# EAGLE design 9key_rev0.1a (EAGLE 8.3.1)

## Sheet 1 of 2
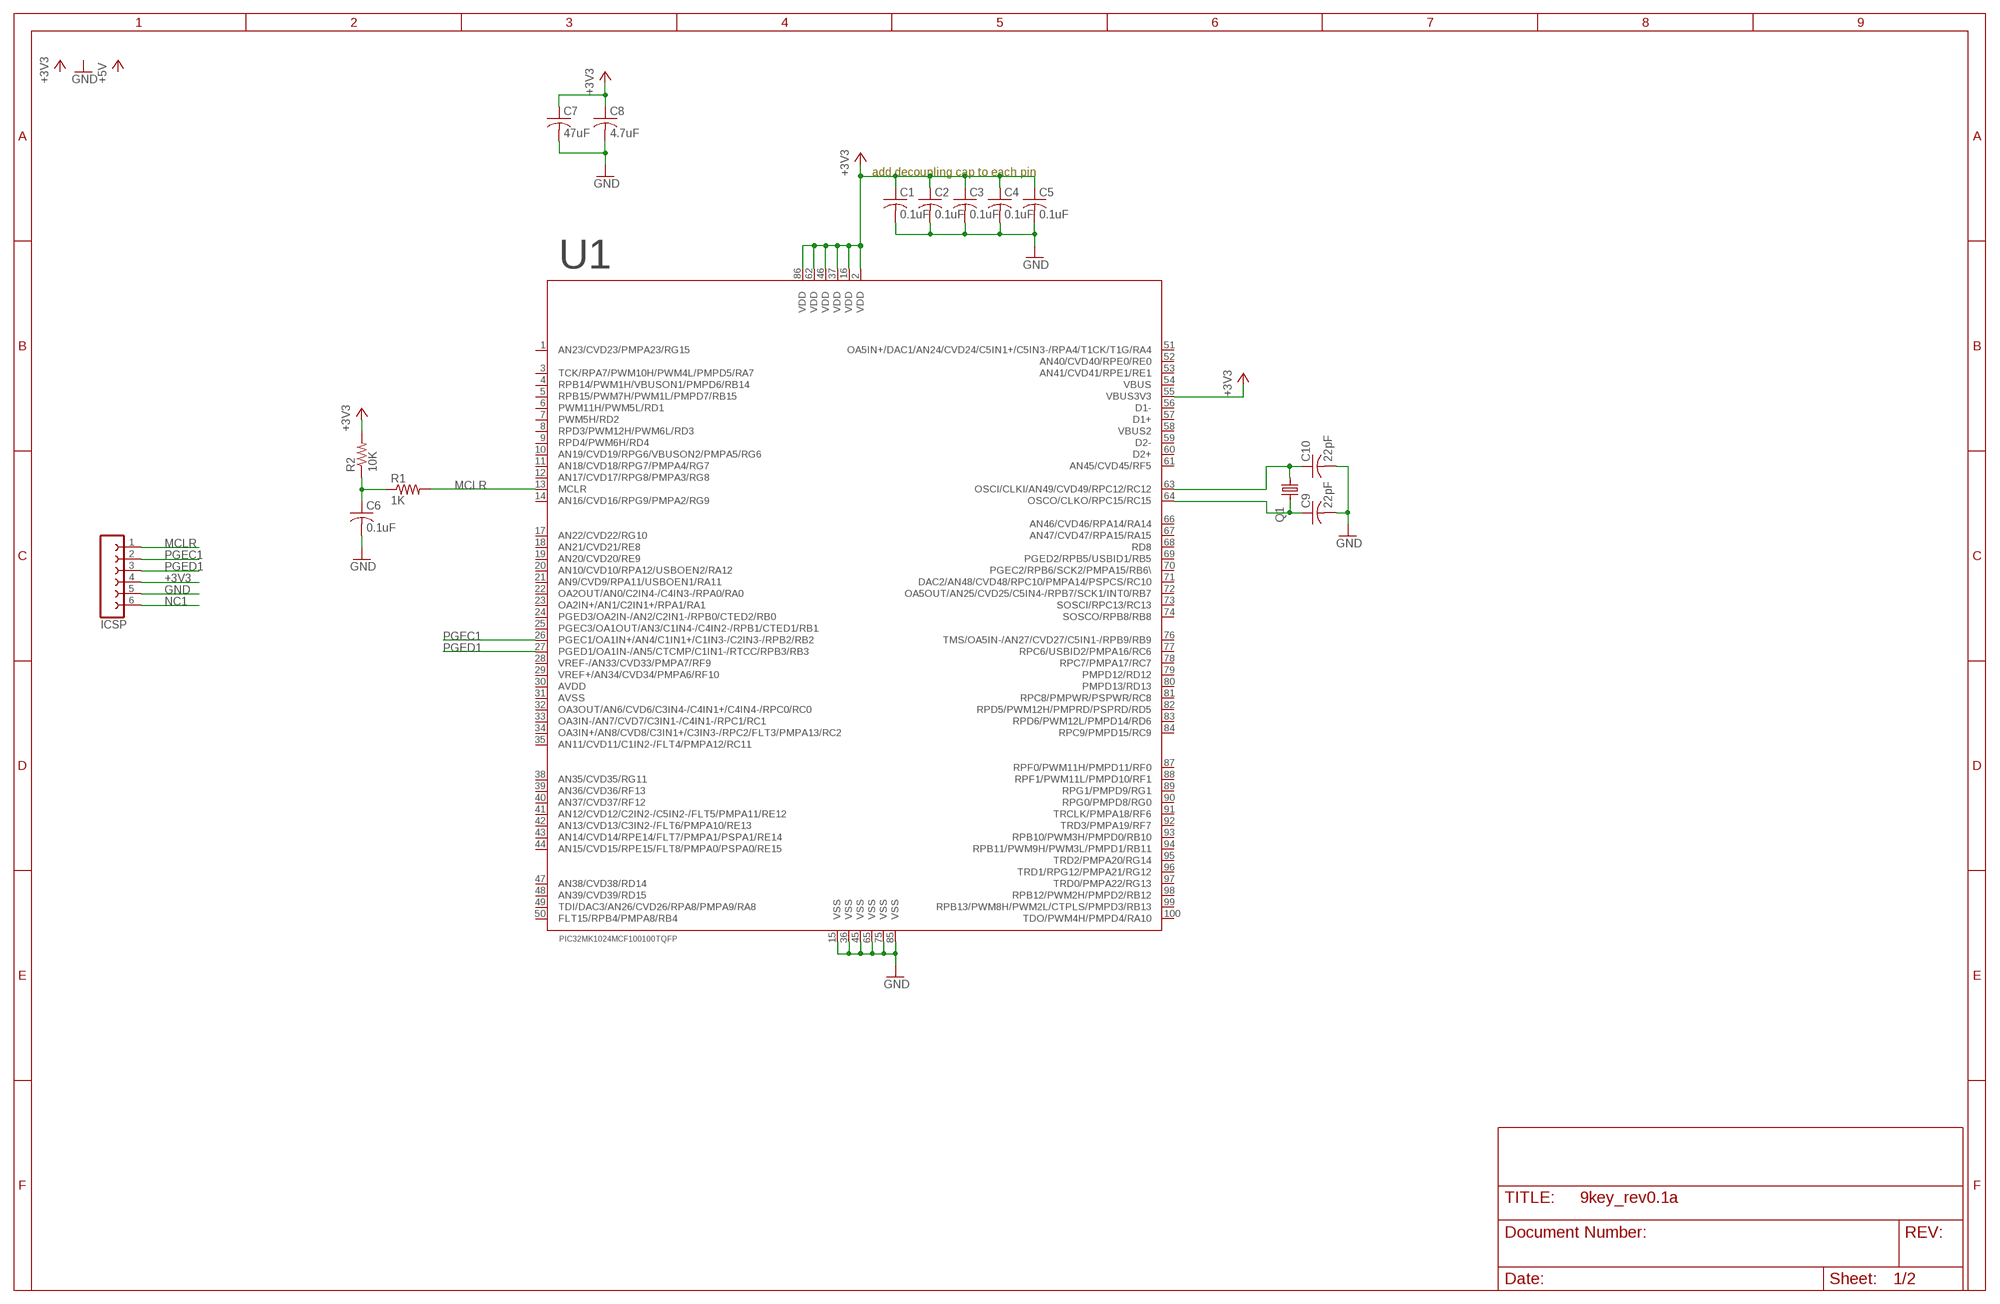
[diagram p0: schematic, sheet 1]

### Parts
C1  0.1uF  C-USC0805  [C0805]
C2  0.1uF  C-USC0805  [C0805]
C3  0.1uF  C-USC0805  [C0805]
C4  0.1uF  C-USC0805  [C0805]
C5  0.1uF  C-USC0805  [C0805]
C6  0.1uF  C-USC0805  [C0805]
C7  47uF  C-USC0805  [C0805]
C8  4.7uF  C-USC0805  [C0805]
C9  22pF  C-USC0603  [C0603]
C10  22pF  C-USC0603  [C0603]
ICSP  FE06-1  [FE06]
Q1  KX-7  [3.2X2.5_KX-7]
R1  1K  R-US_R0805  [R0805]
R2  10K  R-US_R0805  [R0805]
U1  PIC32MK1024MCF100100TQFP  [PIC32MK1024MCF100]

### Nets
+3V3: C1.1 C2.1 C3.1 C4.1 C5.1 C7.1 C8.1 ICSP.4 R2.2 U1.2(VDD) U1.16(VDD) U1.37(VDD) U1.46(VDD) U1.55(VBUS3V3) U1.62(VDD) U1.86(VDD)
GND: C1.2 C2.2 C3.2 C4.2 C5.2 C6.2 C7.2 C8.2 C9.2 C10.2 ICSP.5 U1.15(VSS) U1.36(VSS) U1.45(VSS) U1.65(VSS) U1.75(VSS) U1.85(VSS)
MCLR: ICSP.1 R1.2 U1.13(MCLR)
N$5: C6.1 R1.1 R2.1
NC1: ICSP.6
OSCIN: C10.1 Q1.1 U1.63(OSCI/CLKI/AN49/CVD49/RPC12/RC12)
OSCOUT: C9.1 Q1.3 U1.64(OSCO/CLKO/RPC15/RC15)
PGEC1: ICSP.2 U1.26(PGEC1/OA1IN+/AN4/C1IN1+/C1IN3-/C2IN3-/RPB2/RB2)
PGED1: ICSP.3 U1.27(PGED1/OA1IN-/AN5/CTCMP/C1IN1-/RTCC/RPB3/RB3)
Unconnected: U1.1(AN23/CVD23/PMPA23/RG15) U1.3(TCK/RPA7/PWM10H/PWM4L/PMPD5/RA7) U1.4(RPB14/PWM1H/VBUSON1/PMPD6/RB14) U1.5(RPB15/PWM7H/PWM1L/PMPD7/RB15) U1.6(PWM11H/PWM5L/RD1) U1.7(PWM5H/RD2) U1.8(RPD3/PWM12H/PWM6L/RD3) U1.9(RPD4/PWM6H/RD4) U1.10(AN19/CVD19/RPG6/VBUSON2/PMPA5/RG6) U1.11(AN18/CVD18/RPG7/PMPA4/RG7) U1.12(AN17/CVD17/RPG8/PMPA3/RG8) U1.14(AN16/CVD16/RPG9/PMPA2/RG9) U1.17(AN22/CVD22/RG10) U1.18(AN21/CVD21/RE8) U1.19(AN20/CVD20/RE9) U1.20(AN10/CVD10/RPA12/USBOEN2/RA12) U1.21(AN9/CVD9/RPA11/USBOEN1/RA11) U1.22(OA2OUT/AN0/C2IN4-/C4IN3-/RPA0/RA0) U1.23(OA2IN+/AN1/C2IN1+/RPA1/RA1) U1.24(PGED3/OA2IN-/AN2/C2IN1-/RPB0/CTED2/RB0) U1.25(PGEC3/OA1OUT/AN3/C1IN4-/C4IN2-/RPB1/CTED1/RB1) U1.28(VREF-/AN33/CVD33/PMPA7/RF9) U1.29(VREF+/AN34/CVD34/PMPA6/RF10) U1.30(AVDD) U1.31(AVSS) U1.32(OA3OUT/AN6/CVD6/C3IN4-/C4IN1+/C4IN4-/RPC0/RC0) U1.33(OA3IN-/AN7/CVD7/C3IN1-/C4IN1-/RPC1/RC1) U1.34(OA3IN+/AN8/CVD8/C3IN1+/C3IN3-/RPC2/FLT3/PMPA13/RC2) U1.35(AN11/CVD11/C1IN2-/FLT4/PMPA12/RC11) U1.38(AN35/CVD35/RG11) U1.39(AN36/CVD36/RF13) U1.40(AN37/CVD37/RF12) U1.41(AN12/CVD12/C2IN2-/C5IN2-/FLT5/PMPA11/RE12) U1.42(AN13/CVD13/C3IN2-/FLT6/PMPA10/RE13) U1.43(AN14/CVD14/RPE14/FLT7/PMPA1/PSPA1/RE14) U1.44(AN15/CVD15/RPE15/FLT8/PMPA0/PSPA0/RE15) U1.47(AN38/CVD38/RD14) U1.48(AN39/CVD39/RD15) U1.49(TDI/DAC3/AN26/CVD26/RPA8/PMPA9/RA8) U1.50(FLT15/RPB4/PMPA8/RB4) U1.51(OA5IN+/DAC1/AN24/CVD24/C5IN1+/C5IN3-/RPA4/T1CK/T1G/RA4) U1.52(AN40/CVD40/RPE0/RE0) U1.53(AN41/CVD41/RPE1/RE1) U1.54(VBUS) U1.56(D1-) U1.57(D1+) U1.58(VBUS2) U1.59(D2-) U1.60(D2+) U1.61(AN45/CVD45/RF5) U1.66(AN46/CVD46/RPA14/RA14) U1.67(AN47/CVD47/RPA15/RA15) U1.68(RD8) U1.69(PGED2/RPB5/USBID1/RB5) U1.70(PGEC2/RPB6/SCK2/PMPA15/RB6\) U1.71(DAC2/AN48/CVD48/RPC10/PMPA14/PSPCS/RC10) U1.72(OA5OUT/AN25/CVD25/C5IN4-/RPB7/SCK1/INT0/RB7) U1.73(SOSCI/RPC13/RC13) U1.74(SOSCO/RPB8/RB8) U1.76(TMS/OA5IN-/AN27/CVD27/C5IN1-/RPB9/RB9) U1.77(RPC6/USBID2/PMPA16/RC6) U1.78(RPC7/PMPA17/RC7) U1.79(PMPD12/RD12) U1.80(PMPD13/RD13) U1.81(RPC8/PMPWR/PSPWR/RC8) U1.82(RPD5/PWM12H/PMPRD/PSPRD/RD5) U1.83(RPD6/PWM12L/PMPD14/RD6) U1.84(RPC9/PMPD15/RC9) U1.87(RPF0/PWM11H/PMPD11/RF0) U1.88(RPF1/PWM11L/PMPD10/RF1) U1.89(RPG1/PMPD9/RG1) U1.90(RPG0/PMPD8/RG0) U1.91(TRCLK/PMPA18/RF6) U1.92(TRD3/PMPA19/RF7) U1.93(RPB10/PWM3H/PMPD0/RB10) U1.94(RPB11/PWM9H/PWM3L/PMPD1/RB11) U1.95(TRD2/PMPA20/RG14) U1.96(TRD1/RPG12/PMPA21/RG12) U1.97(TRD0/PMPA22/RG13) U1.98(RPB12/PWM2H/PMPD2/RB12) U1.99(RPB13/PWM8H/PWM2L/CTPLS/PMPD3/RB13) U1.100(TDO/PWM4H/PMPD4/RA10)

### Notes on the sheet
- add decoupling cap to each pin

## Sheet 2 of 2
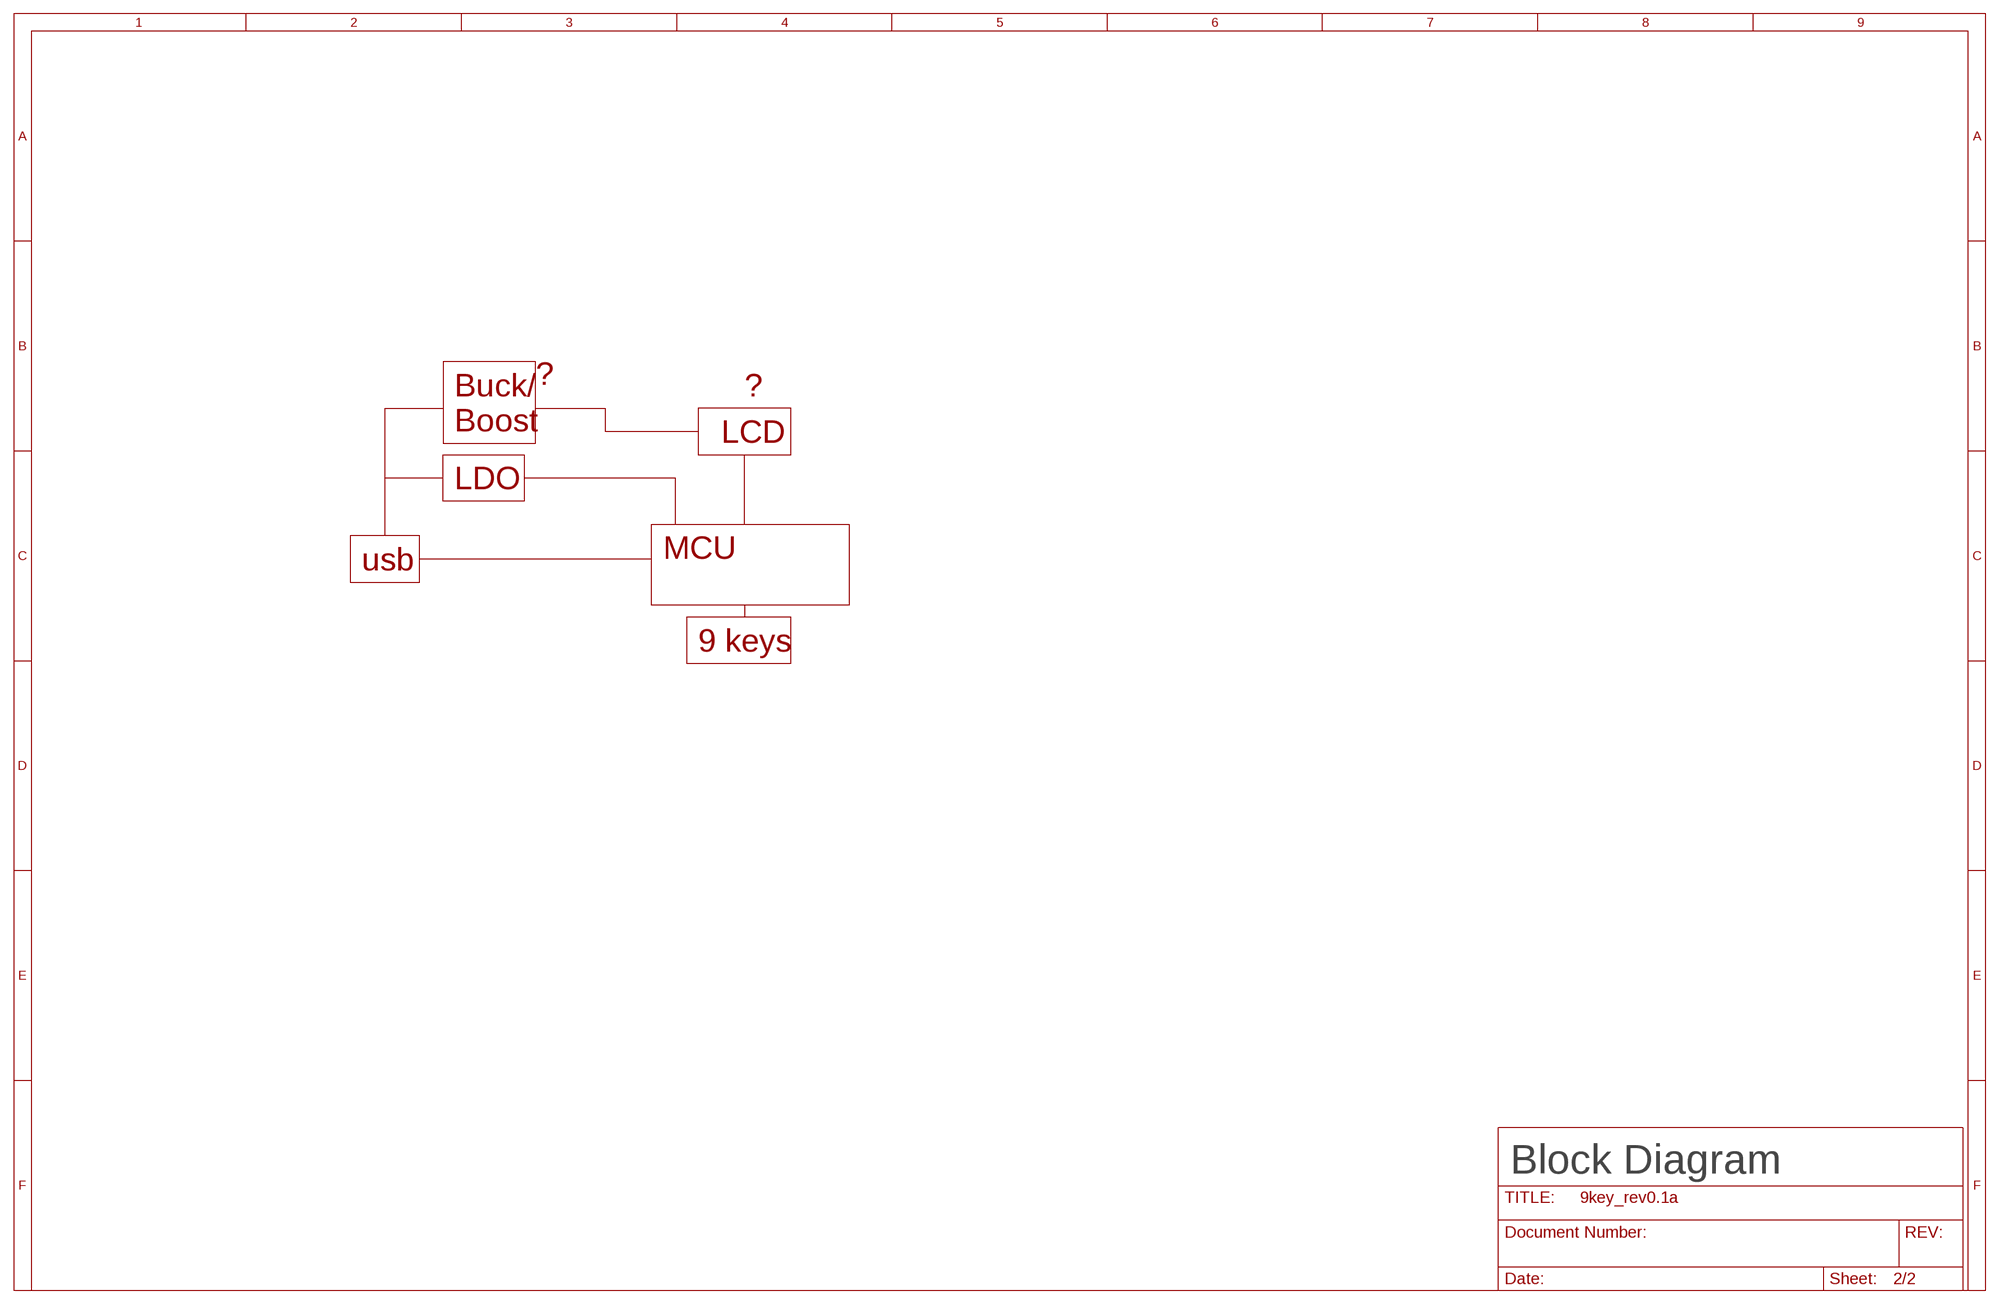
[diagram p1: schematic, sheet 2]

### Notes on the sheet
- ?
- ?
- Buck/
  Boost
- LCD
- LDO
- MCU
- usb
- 9 keys
- Block Diagram

## Library data of the parts
C1-C10 = resistor:C-US: CAPACITOR, American symbol
ICSP = con-lsta:FE06-1: FEMALE HEADER; OC_FARNELL: unknown; OC_NEWARK: unknown
Q1 = crystal-geyer_V1_0:KX: Quartz Crystals (MHz) SMD: KX - Serie Model Size l/w/h [mm] Frequency Range Frequency Stability Temp. Range [°C] Load Capacitance AECQ 200 availabel Datasheet KX-4 KX-5 KX-6 KX-7 KX-9A KX-9B KX-12A KX-12B KX-13 KX-20 KX-K KX-KS 1.6/1.2/0.3 2.0/1.6/0.45 2.5/2.0/0.55 3.2/2.5/0.8 5.0/3.2/1.0 5.0/3.2/1.1 6.0/3.5/1.1 6.0/3.5/1.0 7.0/5.0 /1.3 11.6/5.5/1.6 12.3/4.5/4.2 12.3/4.5/3.2 24.0 ~ 80.0 MHz 16.0 ~ 80.0 MHz 12.0 ~ 80.0 MHz 8.0 ~ 60.0 MHz 7,68 ~ 300,0 MHz 8,0 ~ 50,0 MHz 8,0 ~ 150,0 MHz 8,0 ~ 50,0 MHz 6,0 ~ 160,0 MHz 3,579 ~ 25,0 MHz 3,579 ~ 70,0 MHz 3,579 ~ 70,0 MHz ±10 … ±50ppm ±10 … ±50ppm ±10 … ±50ppm ±10 … ±50ppm ±10 … ±50ppm ±10 … ±50ppm ±10 … ±50ppm ±10 … ±50ppm ±10 … ±50ppm ±50ppm ±10 … ±50ppm ±10 … ±50ppm (*) -40°C …+85°C (*) -40°C …+125°C (*) -40°C …+125°C (*) -40°C …+125°C (*) -40°C …+105°C (*) -40°C …+105°C (*) -40°C …+125°C (*) -40°C …+105°C (*) -40°C …+105°C (*) -40°C …+105°C (*) -40°C …+85°C (*) -40°C …+85°C 8, 8…16 8, 8…16 10, 8…16 12, 7…20 16, 10…20 16, 10…20 16, 10…20 16, 12…20 16, 12…20 16, 12…20 16, 12…30 16, 12…30 - yes yes yes - - - - - - - - KX-4.pdf <http://www.geyer-electronic.de/uploads/tx_userartikelfrequenz/GEYER-KX-4.pdf> KX-5.pdf <http://www.geyer-electronic.de/uploads/tx_userartikelfrequenz/GEYER-KX-5.pdf> KX-6.pdf <http://www.geyer-electronic.de/uploads/tx_userartikelfrequenz/GEYER-KX-6.pdf> KX-7.pdf <http://www.geyer-electronic.de/uploads/tx_userartikelfrequenz/GEYER-KX-7.pdf> KX-9A.pdf <http://www.geyer-electronic.de/uploads/tx_userartikelfrequenz/GEYER-KX-9A.pdf> KX-9B.pdf <http://www.geyer-electronic.de/uploads/tx_userartikelfrequenz/GEYER-KX-9B.pdf> KX-12A.pdf <http://www.geyer-electronic.de/uploads/tx_userartikelfrequenz/GEYER-KX-12A.pdf> KX-12B.pdf <http://www.geyer-electronic.de/uploads/tx_userartikelfrequenz/GEYER-KX-12B.pdf> KX-13.pdf <http://www.geyer-electronic.de/uploads/tx_userartikelfrequenz/GEYER-KX-13.pdf> KX-20.pdf <http://www.geyer-electronic.de/uploads/tx_userartikelfrequenz/GEYER-KX-20.pdf> KX-K.pdf <http://www.geyer-electronic.de/uploads/tx_userartikelfrequenz/GEYER-KX-K.pdf> KX-KS.pdf <http://www.geyer-electronic.de/uploads/tx_userartikelfrequenz/GEYER-KX-KS.pdf> <http://www.geyer-electronic.de/fileadmin/template/img/logo-geyer-electronic.png> Details see: http://www.geyer-electronic.de/Frequenz-Produkte.9.0.html Created 2016-06-07, Hans Locher 2016 (C) Geyer Quartz Technology KX4,KX5,KX6,KX7,KX9A,KX9B,KX12A,KX12B,KX13,KX20,KXK,KXKS;1612;2016;2520;3225;5032;6035;7050;11655;12345;1,6x1,2;2,0x1,6;2,5x2,0;3,2x2,5;5,0x3,2;6,0x3,5;7,0x5,0;11,6x5,5;12,3x4,5;12,3x4,5;1.6x1.2;2.0x1.6;2.5x2.0;3.2x2.5;5.0x3.2;6.0x3.5;7.0x5.0;11.6x5.5;12.3x4.5;12.3x4.5;
R1 R2 = resistor:R-US_: RESISTOR, American symbol
U1 = clackboard_lib:PIC32MK1024MCF100

## Board
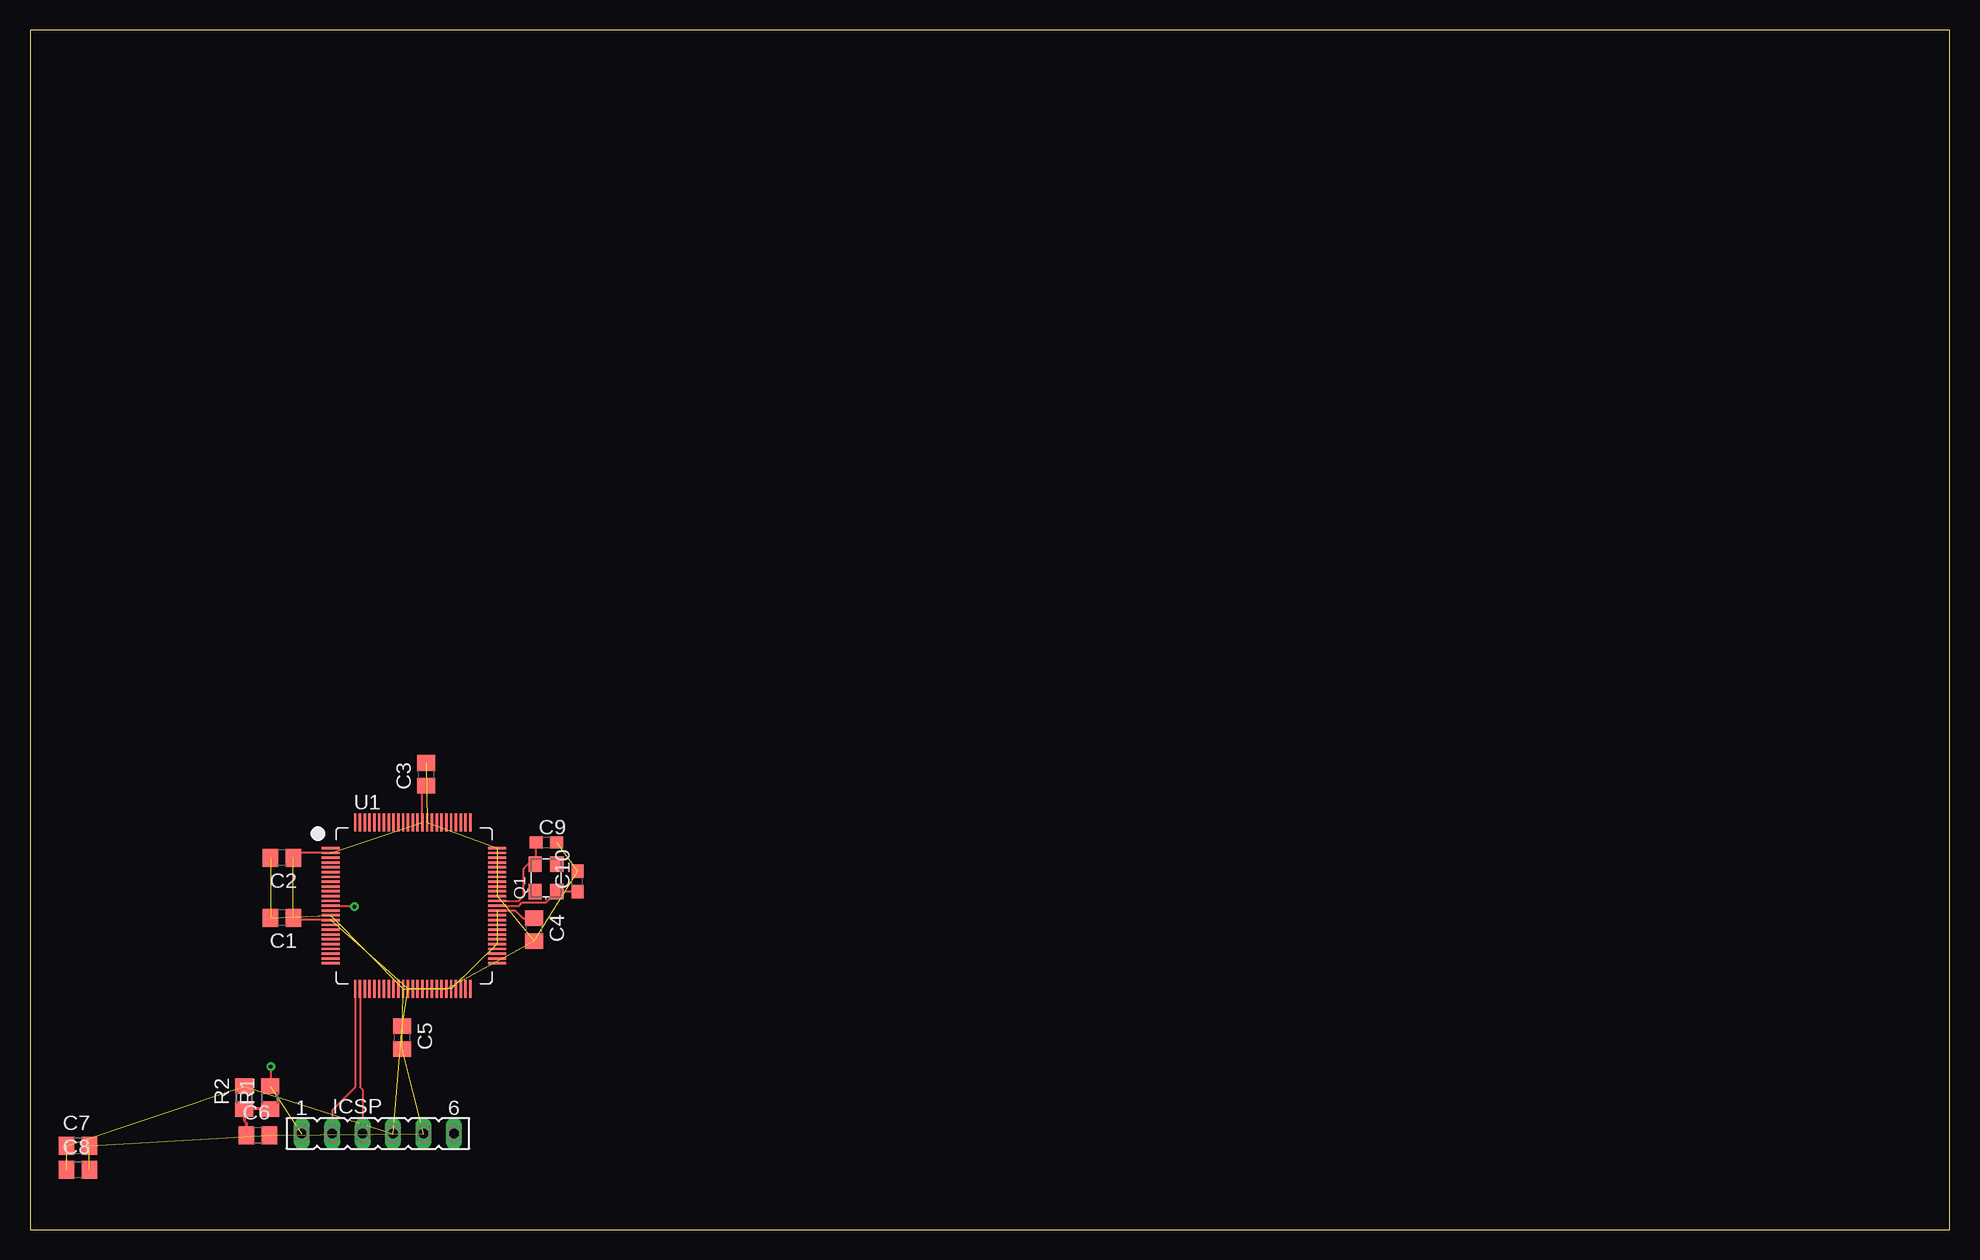
[diagram p2: board, top side]
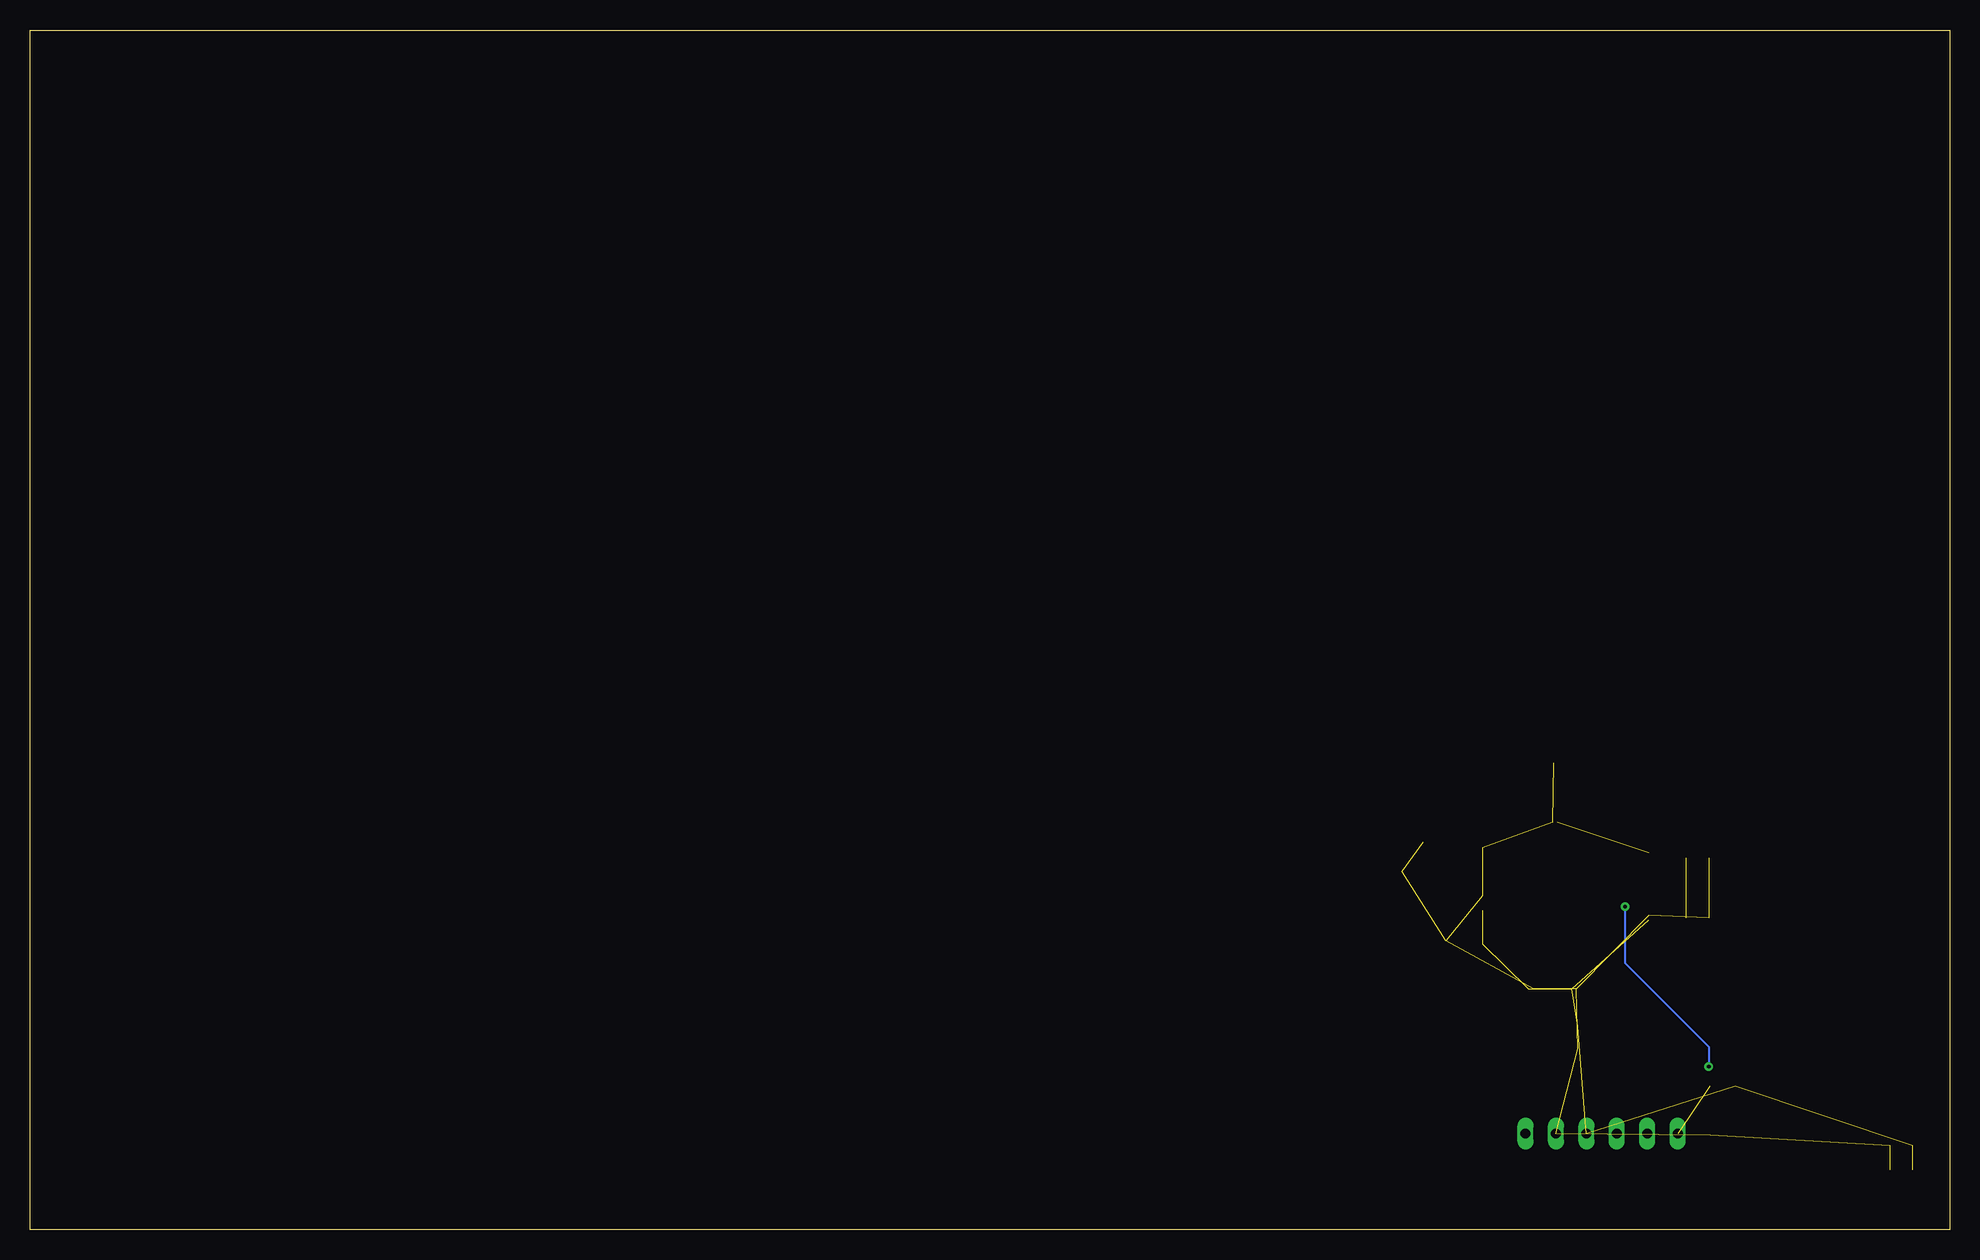
[diagram p3: board, bottom side, seen from below]

Size 160 x 100 mm. Coordinates in mm from the lower left corner, seen from the top.
Outline: 0,0 160,0 160,100 0,100 0,0
Copper layers (1*16): Top 0.035mm / dielectric 1.5mm / Bottom 0.035mm
Design rules "default": minimum track width 6mil, minimum drill 0.35mm, track to track 6mil, track to pad 6mil, pad to pad 6mil, via to via 6mil, smd to smd 6mil, copper to edge 40mil, drill to drill 6mil, minimum pad ring 10mil, minimum via ring 8mil, stop-mask expansion 4mil, vias tented up to drill 0mil, thermal gap 10mil

### Footprints (pad centres in the part's own frame; a part is rotated, then mirrored left to right if it is on the bottom)
C0805 = smd 1.3 x 1.5: 1 -0.95,0; 2 0.95,0
C0603 = smd 1.1 x 1: 1 -0.85,0; 2 0.85,0
FE06 = drill 0.813 long: 1 -6.35,0; 2 -3.81,0; 3 -1.27,0; 4 1.27,0; 5 3.81,0; 6 6.35,0
3.2X2.5_KX-7 = smd 1.3 x 1.1: 1 -1.15,-0.9; 2 1.15,-0.9; 3 1.15,0.9; 4 -1.15,0.9
R0805 = smd 1.3 x 1.5: 1 -0.95,0; 2 0.95,0
PIC32MK1024MCF100 = smd 1.5 x 0.2: 1 -6.95,4.8; 2 -6.95,4.4; 3 -6.95,4; 4 -6.95,3.6; 5 -6.95,3.2; 6 -6.95,2.8; 7 -6.95,2.4; 8 -6.95,2; 9 -6.95,1.6; 10 -6.95,1.2; 11 -6.95,0.8; 12 -6.95,0.4; 13 -6.95,0; 14 -6.95,-0.4; 15 -6.95,-0.8; 16 -6.95,-1.2; 17 -6.95,-1.6; 18 -6.95,-2; 19 -6.95,-2.4; 20 -6.95,-2.8; 21 -6.95,-3.2; 22 -6.95,-3.6; 23 -6.95,-4; 24 -6.95,-4.4; 25 -6.95,-4.8; 51 6.95,-4.8; 52 6.95,-4.4; 53 6.95,-4; 54 6.95,-3.6; 55 6.95,-3.2; 56 6.95,-2.8; 57 6.95,-2.4; 58 6.95,-2; 59 6.95,-1.6; 60 6.95,-1.2; 61 6.95,-0.8; 62 6.95,-0.4; 63 6.95,0; 64 6.95,0.4; 65 6.95,0.8; 66 6.95,1.2; 67 6.95,1.6; 68 6.95,2; 69 6.95,2.4; 70 6.95,2.8; 71 6.95,3.2; 72 6.95,3.6; 73 6.95,4; 74 6.95,4.4; 75 6.95,4.8 | smd 0.2 x 1.5: 26 -4.9,-6.95; 27 -4.5,-6.95; 28 -4.1,-6.95; 29 -3.7,-6.95; 30 -3.3,-6.95; 31 -2.9,-6.95; 32 -2.5,-6.95; 33 -2.1,-6.95; 34 -1.7,-6.95; 35 -1.3,-6.95; 36 -0.9,-6.95; 37 -0.5,-6.95; 38 -0.1,-6.95; 39 0.3,-6.95; 40 0.7,-6.95; 41 1.1,-6.95; 42 1.5,-6.95; 43 1.9,-6.95; 44 2.3,-6.95; 45 2.7,-6.95; 46 3.1,-6.95; 47 3.5,-6.95; 48 3.9,-6.95; 49 4.3,-6.95; 50 4.7,-6.95; 76 4.7,6.95; 77 4.3,6.95; 78 3.9,6.95; 79 3.5,6.95; 80 3.1,6.95; 81 2.7,6.95; 82 2.3,6.95; 83 1.9,6.95; 84 1.5,6.95; 85 1.1,6.95; 86 0.7,6.95; 87 0.3,6.95; 88 -0.1,6.95; 89 -0.5,6.95; 90 -0.9,6.95; 91 -1.3,6.95; 92 -1.7,6.95; 93 -2.1,6.95; 94 -2.5,6.95; 95 -2.9,6.95; 96 -3.3,6.95; 97 -3.7,6.95; 98 -4.1,6.95; 99 -4.5,6.95; 100 -4.9,6.95

### Placement (x,y rotation side)
C1  21,26 180 top
C2  21,31 180 top
C3  33.04,37.95 90 top
C4  42,25 270 top
C5  31,16 270 top
C6  19,7.87 0 top
C7  4,7 0 top
C8  4,5 0 top
C9  43.04,32.29 0 top
C10  45.63,29.02 90 top
ICSP  29,8 0 top
Q1  43.01,29.31 90 top
R1  20,11 90 top
R2  17.87,11 90 top
U1  32,27 0 top

### Tracks (layer width: path | path; a pad name or v marks a point on that pad's centre or on a via)
+3V3  (11 unrouted)
  Top 0.152: U1.16 22.15,25.8 C1.1 | U1.2 22.35,31.4 C2.1 | U1.86 32.7,36.66 C3.1 | U1.62 40.46,26.6 41.11,25.95 C4.1
GND  (16 unrouted)
MCLR  (via drill 0.3)  (1 unrouted)
  Top 0.152: U1.13 26.98,27 v27.05,26.92 | v20.07,13.59 20.07,12.02 R1.2
  Bottom 0.152: v27.05,26.92 27.05,22.23 20.07,15.24 v20.07,13.59
N$5
  Top 0.254: C6.1 18.03,7.89 18.03,8.89 17.87,9.05 R2.1 R1.1
OSCIN
  Top 0.152: U1.63 40.77,27 41.03,27.27 43.02,27.27 Q1.1 C10.1
OSCOUT
  Top 0.152: U1.64 40.73,27.4 41.15,27.81 41.15,30.1 41.51,30.46 Q1.3 42.19,30.54 C9.1
PGEC1
  Top 0.152: U1.26 27.1,11.86 25.19,9.95 ICSP.2
PGED1
  Top 0.152: U1.27 27.5,11.87 27.73,11.64 ICSP.3